# Altium schematic sheet Midas.SchDoc
size A4; SheetNumber: 1; SheetTotal: 1
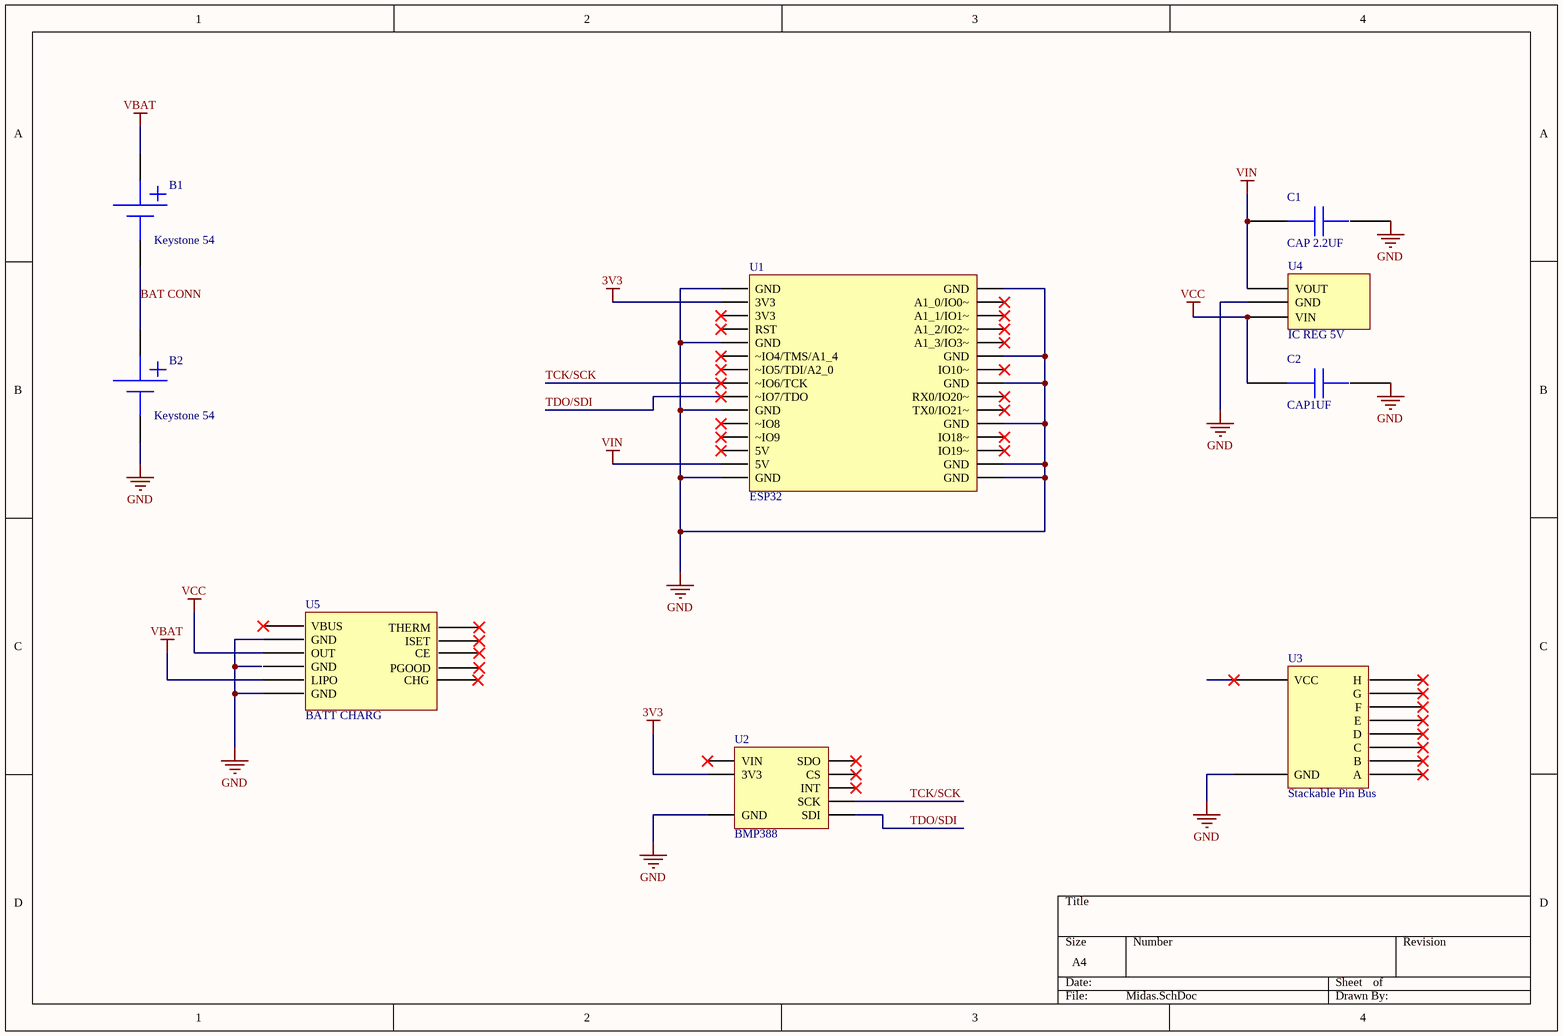
[diagram p0: Midas.SchDoc]

## Parts
B1  Keystone 54  [Keystone 54]
B2  Keystone 54  [Keystone 54]
C1  CAP 2.2UF  [FA16X7R1E225KNU06]
C2  CAP1UF  [C330C105K5R5TA7301]
U1  ESP32  [ESP32]
U2  BMP388  [3966]
U3  Stackable Pin Bus  [STACKABLE_PIN_BUS]
U4  IC REG 5V  [AP7381-50V-A]
U5  BATT CHARG  [4755]

## Nets
3V3: U1.2(3V3) U2.2(3V3)
GND: B2.2(NEG) C1.2 C2.2 U1.1(GND) U1.5(GND) U1.10(GND) U1.15(GND) U1.16(GND) U1.17(GND) U1.20(GND) U1.23(GND) U1.25(GND) U1.30(GND) U2.3(GND) U3.2(GND) U4.2(GND) U5.2(GND) U5.11(GND)
VBAT: B1.1(POS) U5.10(LIPO)
VCC: C2.1 U4.3(VIN) U5.8(OUT)
VIN: C1.1 U1.14(5V) U4.1(VOUT)
BAT CONN: B1.2(NEG) B2.1(POS)
TCK/SCK: U1.8(~IO6/TCK) U2.4(SCK)
TDO/SDI: U1.9(~IO7/TDO) U2.6(SDI)

Not connected (* = marked no-connect by the designer): U1 3(3V3)* 4(RST)* 6(~IO4/TMS/A1_4)* 7(~IO5/TDI/A2_0)* 11(~IO8)* 12(~IO9)* 13(5V)* 18(IO19~)* 19(IO18~)* 21(TX0/IO21~)* 22(RX0/IO20~)* 24(IO10~)* 26(A1_3/IO3~)* 27(A1_2/IO2~)* 28(A1_1/IO1~)* 29(A1_0/IO0~)*; U2 1(VIN)* 5(SDO)* 7(CS)* 8(INT)*; U3 1(VCC)* 3(A)* 4(B)* 5(C)* 6(D)* 7(E)* 8(F)* 9(G)* 10(H)*; U5 1(VBUS)* 3(THERM)* 4(ISET)* 5(CE)* 6(PGOOD)* 7(CHG)* 9(GND)

## Library data of the parts
B1 B2 = 54: Batteries/Accessories / BATT CONT CLIP 18650 1CEL PC PIN; Manufacturer: Keystone Electronics; Supplier: Digikey; Supplier Part Number: 36-54-ND; Manufacturer Part Number: 54; RoHS: Yes; Category: Batteries and Accessories; Stock: 21286; Pricing: 1=0,69, 25=0,5828, 100=0,55, 250=0,51576, 500=0,4587, 1000=0,3893, 2500=0,35554, 5000=0,32854 (USD); ComponentLink1URL: https://datasheet.ciiva.com:443/pdfs/VipMasterIC/IC/KEYC/KEYC-S-A0001371036/KEYC-S-A0001371130-1.pdf?src-supplier=IHS+Markit; ComponentLink1Description: https://datasheet.ciiva.com:443/pdfs/VipMasterIC/IC/KEYC/KEYC-S-A0001371036/KEYC-S-A0001371130-1.pdf?src-supplier=IHS+Markit; ComponentLink2URL: http://www.farnell.com/datasheets/1898890.pdf?src-supplier=Farnell; ComponentLink2Description: http://www.farnell.com/datasheets/1898890.pdf?src-supplier=Farnell; ComponentLink3URL: http://keyelco.com/userAssets/file/M65p11.pdf?src-supplier=Digikey; ComponentLink3Description: http://keyelco.com/userAssets/file/M65p11.pdf?src-supplier=Digikey; ComponentLink4URL: http://www.farnell.com/datasheets/1898890.pdf?src-supplier=Newark; ComponentLink4Description: http://www.farnell.com/datasheets/1898890.pdf?src-supplier=Newark
C1 = FA16X7R1E225KNU06: Ceramic Capacitor, Multilayer, Ceramic, 25V, 10% +Tol, 10% -Tol, X7R, 15% TC, 2.2uF, Through Hole Mount; Manufacturer: TDK; Supplier: Digikey; Supplier Part Number: 445-180433-1-ND; Manufacturer Part Number: FA16X7R1E225KNU06; RoHS: Yes; Category: Ceramic Capacitors; Stock: 7883; Pricing: 1=0,5, 10=0,332, 50=0,2448, 100=0,1993, 500=0,15736, 1000=0,13288 (USD); Pins: 2; Dielectric Material: Ceramic; Capacitor Type: Ceramic; Reach SVHC Compliant: Yes; RoHS Compliant: Yes; ComponentLink1URL: https://datasheet.ciiva.com:443/pdfs/VipMasterIC/IC/TDKC/TDKC-S-A0009903855/TDKC-S-A0009903855-1.pdf?src-supplier=IHS+Markit; ComponentLink1Description: https://datasheet.ciiva.com:443/pdfs/VipMasterIC/IC/TDKC/TDKC-S-A0009903855/TDKC-S-A0009903855-1.pdf?src-supplier=IHS+Markit; ComponentLink2URL: https://product.tdk.com/info/en/catalog/datasheets/leadmlcc_halogenfree_fa_en.pdf?src-supplier=Digikey; ComponentLink2Description: https://product.tdk.com/info/en/catalog/datasheets/leadmlcc_halogenfree_fa_en.pdf?src-supplier=Digikey
C2 = C330C105K5R5TA7301: Ceramic Capacitor, Multilayer, Ceramic, 50V, 10% +Tol, 10% -Tol, X7R, 15% TC, 1uF, Through Hole Mount; Manufacturer: KEMET; Multilayer: Yes; Supplier: Digikey; Supplier Part Number: 399-9886-1-ND; Manufacturer Part Number: C330C105K5R5TA7301; RoHS: Yes; Category: Ceramic Capacitors; Stock: 95810; Pricing: 1=0,48, 10=0,322, 50=0,2562, 100=0,2115, 500=0,16524 (USD); Mounting Technology: Through Hole; Pins: 2; Dielectric Material: Ceramic; Package Shape: Rectangular; Case/Package: 3015; Terminal Finish: Nickel; Min Operating Temperature: -55°C; Max Operating Temperature: 125°C; JESD-609 Code: e3; Value: 1uF; Capacitor Type: Ceramic; Tolerance  (fill in as +-): 10%; Package Style: RadialMeter; Packaging: Tape and Reel; Tolerance (fill in as +-): 10%; Rated DC Voltage (URdc): 50V; Temperature Characteristics Code: X7R; Termination: Wire; Length: 7.62mm; Width: 3.81mm; Height: 9.14mm; Terminal Pitch: 5.08mm; Reach SVHC Compliant: Yes; RoHS Compliant: Yes; ComponentLink1URL: https://datasheet.ciiva.com:443/pdfs/VipMasterIC/IC/KEME/KEME-S-A0009782347/KEME-S-A0009782347-1.pdf?src-supplier=IHS+Markit; ComponentLink1Description: https://datasheet.ciiva.com:443/pdfs/VipMasterIC/IC/KEME/KEME-S-A0009782347/KEME-S-A0009782347-1.pdf?src-supplier=IHS+Markit; ComponentLink2URL: https://datasheet.ciiva.com/6278/f3101-goldmax-6278031.pdf?src-supplier=Digikey; ComponentLink2Description: https://datasheet.ciiva.com/6278/f3101-goldmax-6278031.pdf?src-supplier=Digikey
U1 = ESP32-C3-DEVKITC-02: Manufacturer: Espressif Systems; Supplier: Digikey; Supplier Part Number: 1965-ESP32-C3-DEVKITC-02-ND; Manufacturer Part Number: ESP32-C3-DEVKITC-02; RoHS: No; Category: RF Semiconductors and Devices; Stock: 1074; Pricing: 1=8 (USD)
U2 = 3966: Test Lead, Blk, Red, 139.7MM, 500V 3V ~ 5V / Adafruit Industries LLC / BMP388 - Pressure Sensor Evaluation Board / BMP388; Supplier: Digikey; Supplier Part Number: 1528-2733-ND; Manufacturer: Adafruit Industries; Manufacturer Part Number: 3966; RoHS: No; Category: Pressure Sensors; Stock: 21; Pricing: 1=9,95 (USD)
U3 = Barramento Empilhável: 10 pinos, Passo 2.54mm, Dimensões da barra 26x2x8mm
U4 = AP7381-50V-A: Fixed Positive LDO Regulator; Manufacturer: Diodes; Regulator Type: FIXED POSITIVE SINGLE OUTPUT LDO REGULATOR; Time @ Peak Reflow Temperature-Max (s): 30s; Supplier: Digikey; Supplier Part Number: AP7381-50V-ADICT-ND; Manufacturer Part Number: AP7381-50V-A; RoHS: Yes; Stock: 6439; Pricing: 1=0,46, 10=0,374, 25=0,3424, 100=0,2547, 250=0,2308, 500=0,19102, 1000=0,14326 (USD); Peak Reflow Temperature (Cel): 260°C; Reach SVHC Compliant: Yes; RoHS Compliant: Yes; ComponentLink1URL: https://datasheet.ciiva.com:443/pdfs/VipMasterIC/IC/DIOD/DIOD-S-A0009691348/DIOD-S-A0009865550-1.pdf?src-supplier=IHS+Markit; ComponentLink1Description: https://datasheet.ciiva.com:443/pdfs/VipMasterIC/IC/DIOD/DIOD-S-A0009691348/DIOD-S-A0009865550-1.pdf?src-supplier=IHS+Markit; ComponentLink2URL: https://www.diodes.com/assets/Datasheets/AP7381.pdf?src-supplier=Digikey; ComponentLink2Description: https://www.diodes.com/assets/Datasheets/AP7381.pdf?src-supplier=Digikey
U5 = 4755: Manufacturer: Adafruit Industries; Supplier: Digikey; Supplier Part Number: 1528-4755-ND; Manufacturer Part Number: 4755; RoHS: No; Stock: 308; Pricing: 1=14,95 (USD)